# EAGLE schematic EPS (EAGLE 7.5.0)

## Sheet 1 of 3
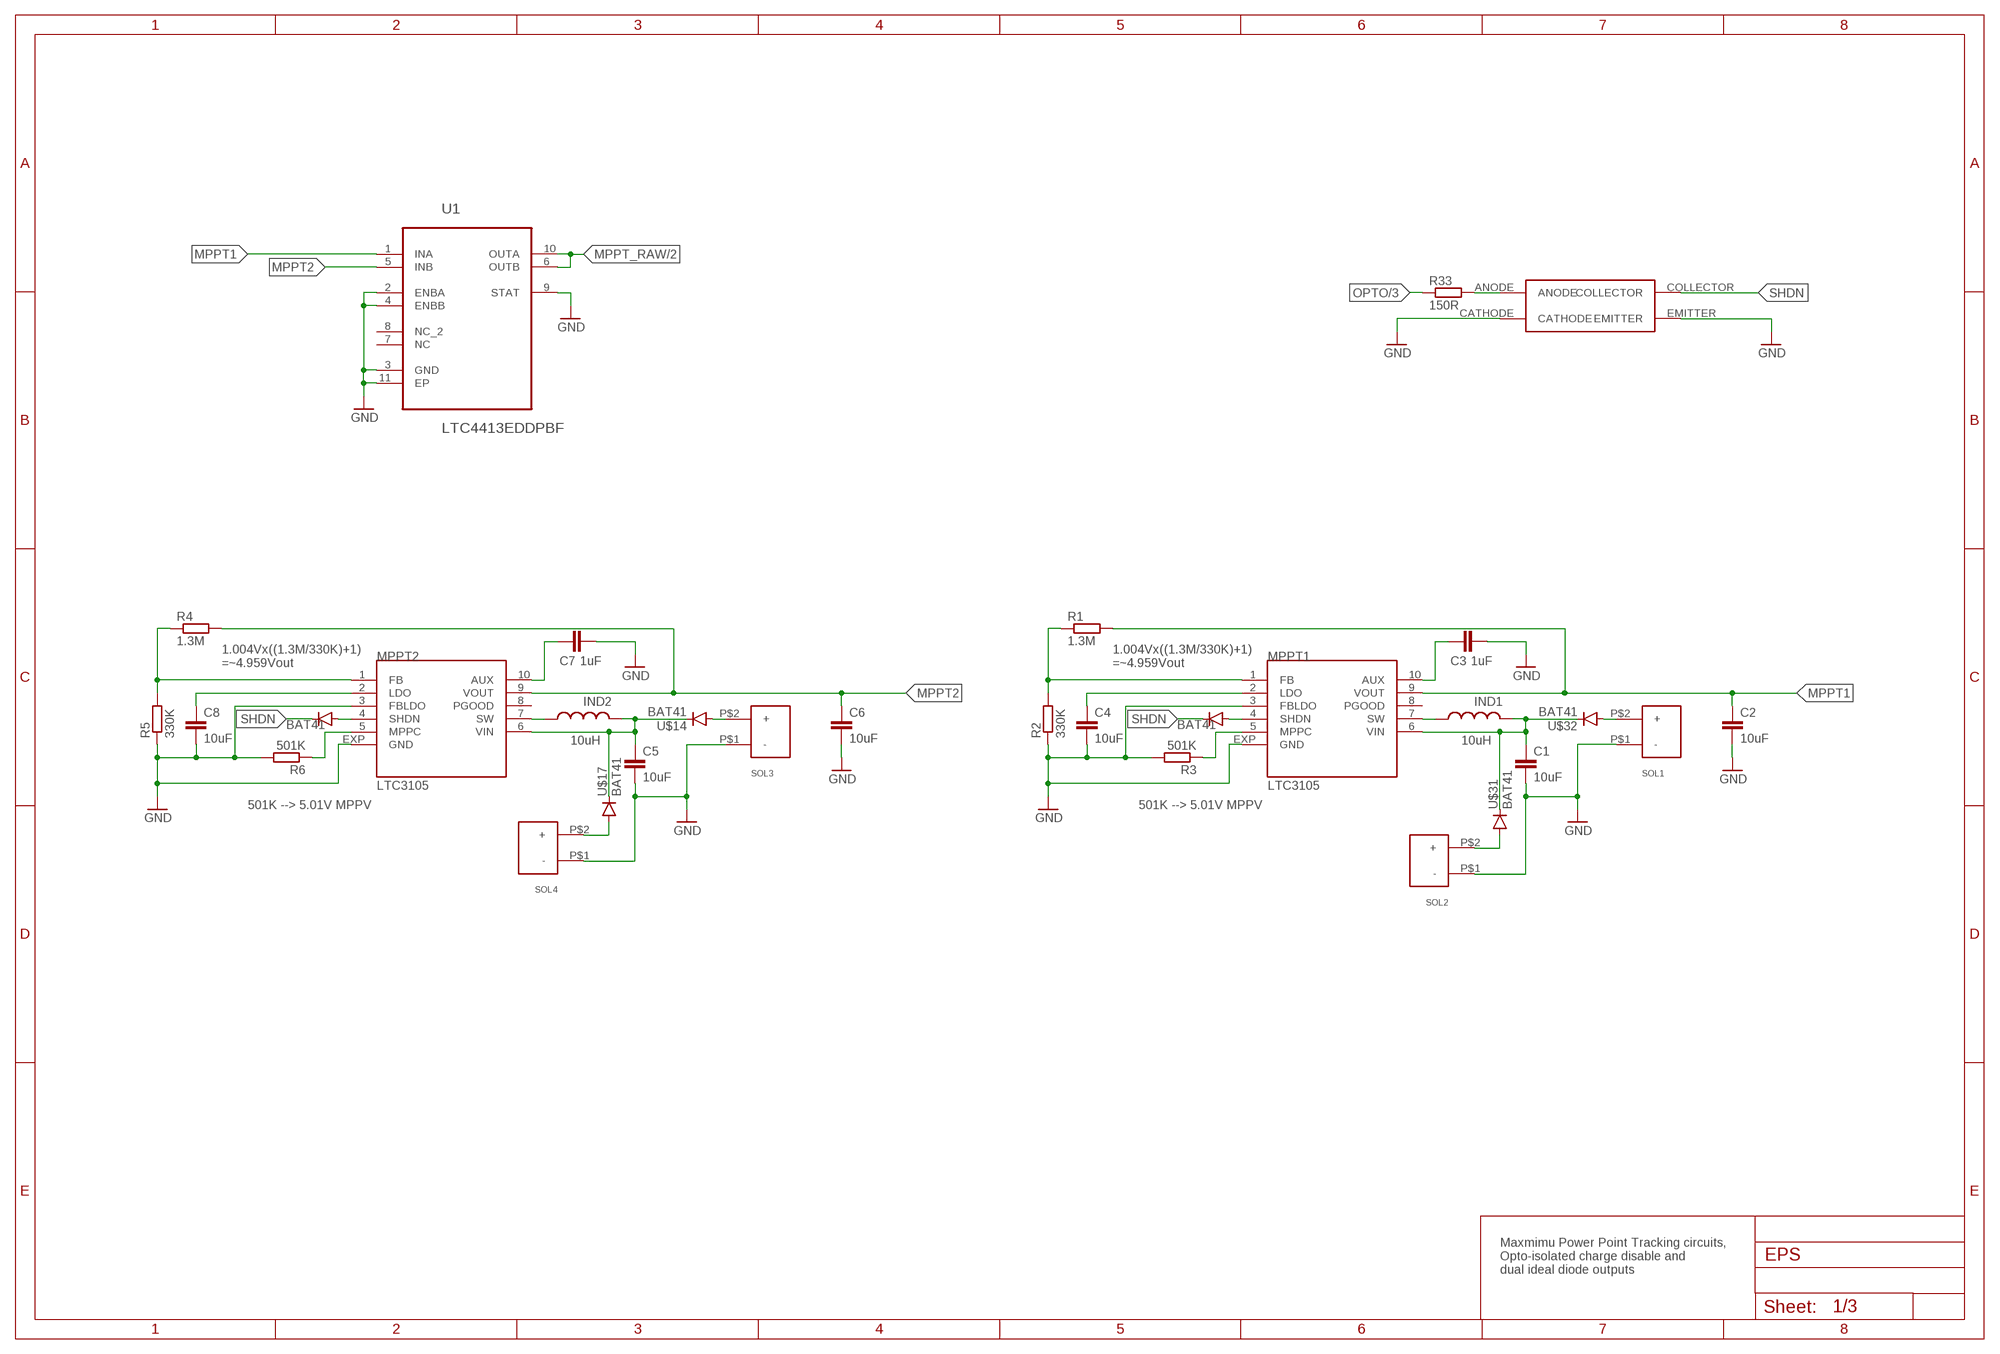
[diagram p0: schematic, sheet 1]

### Parts
C1  10uF  C-EUC0603  [C0603]
C2  10uF  C-EUC0603  [C0603]
C3  1uF  C-EUC0402  [C0402]
C4  10uF  C-EUC0603  [C0603]
C5  10uF  C-EUC0603  [C0603]
C6  10uF  C-EUC0603  [C0603]
C7  1uF  C-EUC0402  [C0402]
C8  10uF  C-EUC0603  [C0603]
IND1  WE-TPC-744031100  [WE-TPC-744031100]
IND2  WE-TPC-744031100  [WE-TPC-744031100]
MPPT1  LTC3105  [DFN-3X3]
MPPT2  LTC3105  [DFN-3X3]
R1  1.3M  R-EU_R0402  [R0402]
R2  330K  R-EU_R0402  [R0402]
R3  501K  R-EU_R0402  [R0402]
R4  1.3M  R-EU_R0402  [R0402]
R5  330K  R-EU_R0402  [R0402]
R6  501K  R-EU_R0402  [R0402]
R33  150R  R-EU_R0402  [R0402]
SOL1  JST-B2B-ZH  [JST-B2B-ZR]
SOL2  JST-B2B-ZH  [JST-B2B-ZR]
SOL3  JST-B2B-ZH  [JST-B2B-ZR]
SOL4  JST-B2B-ZH  [JST-B2B-ZR]
U1  LTC4413EDDPBF  [DFN300X300X80-11N]
U$4  BAT41  [SOD-123]
U$10  BAT41  [SOD-123]
U$14  BAT41  [SOD-123]
U$17  BAT41  [SOD-123]
U$24  EL3H7  [EL3H7]
U$31  BAT41  [SOD-123]
U$32  BAT41  [SOD-123]

### Nets
GND: C1.2 C2.2 C3.2 C4.2 C5.2 C6.2 C7.2 C8.2 MPPT1.3(FBLDO) MPPT1.EXP(GND) MPPT2.3(FBLDO) MPPT2.EXP(GND) R2.1 R3.2 R5.1 R6.2 SOL1.P$1(-) SOL2.P$1(-) SOL3.P$1(-) SOL4.P$1(-) U1.2(ENBA) U1.3(GND) U1.4(ENBB) U1.9(STAT) U1.11(EP) U$24.CATHODE U$24.EMITTER ; also sheet 2,3
MPPT1: C2.1 MPPT1.9(VOUT) R1.2 U1.1(INA)
MPPT2: C6.1 MPPT2.9(VOUT) R4.2 U1.5(INB)
MPPT_RAW: U1.6(OUTB) U1.10(OUTA) ; also sheet 2,3
N$1: IND1.P$1 MPPT1.7(SW)
N$2: C1.1 IND1.P$3 MPPT1.6(VIN) U$31.P$1(C) U$32.P$1(C)
N$3: IND2.P$1 MPPT2.7(SW)
N$4: C3.1 MPPT1.10(AUX)
N$5: C7.1 MPPT2.10(AUX)
N$6: C5.1 IND2.P$3 MPPT2.6(VIN) U$14.P$1(C) U$17.P$1(C)
N$7: MPPT2.1(FB) R4.1 R5.2
N$8: C4.1 MPPT1.2(LDO)
N$9: MPPT1.1(FB) R1.1 R2.2
N$10: MPPT2.5(MPPC) R6.1
N$11: C8.1 MPPT2.2(LDO)
N$12: MPPT2.4(SHDN) U$10.P$2(A)
N$13: SOL4.P$2(+) U$17.P$2(A)
N$14: MPPT1.4(SHDN) U$4.P$2(A)
N$15: MPPT1.5(MPPC) R3.1
N$16: SOL3.P$2(+) U$14.P$2(A)
N$17: SOL2.P$2(+) U$31.P$2(A)
N$18: SOL1.P$2(+) U$32.P$2(A)
N$33: R33.2 U$24.ANODE
OPTO: R33.1 ; also sheet 3
SHDN: U$4.P$1(C) U$10.P$1(C) U$24.COLLECTOR
Unconnected: MPPT1.8(PGOOD) MPPT2.8(PGOOD) U1.7(NC) U1.8(NC_2)

### Notes on the sheet
- 1.004Vx((1.3M/330K)+1)
  =~4.959Vout
- 1.004Vx((1.3M/330K)+1)
  =~4.959Vout
- 10uH | 10uH
- 501K --> 5.01V MPPV | 501K --> 5.01V MPPV
- Maxmimu Power Point Tracking circuits,
  Opto-isolated charge disable and
  dual ideal diode outputs

## Sheet 2 of 3
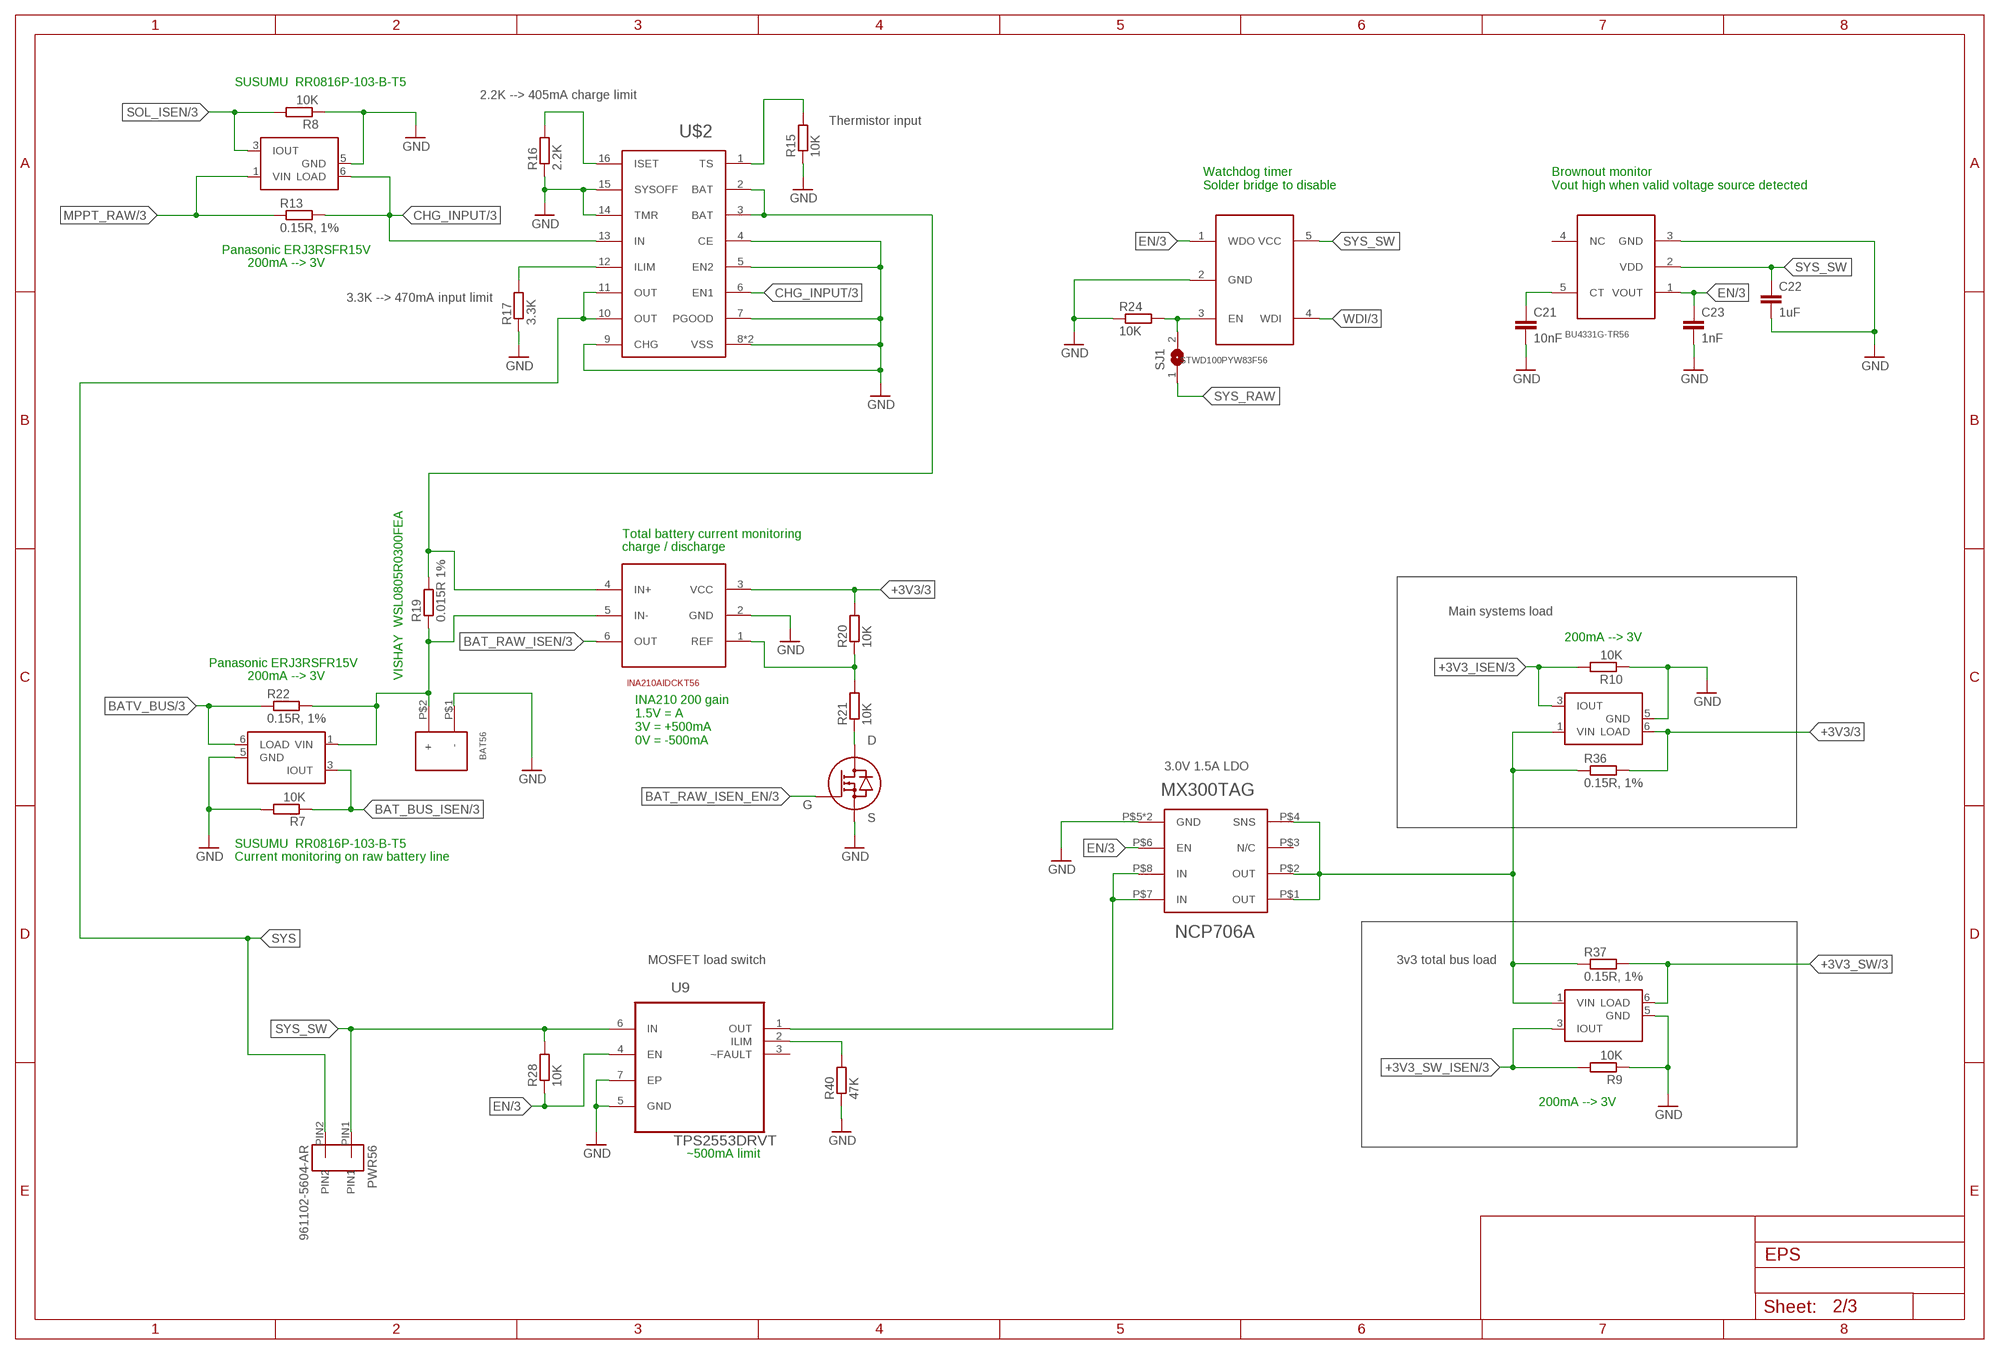
[diagram p1: schematic, sheet 2]

### Parts
BAT56  JST-B2B-ZH  [JST-B2B-ZR]
BU4331G-TR56  BU4231G-TR  [SSOP5]
C21  10nF  C-EUC0402  [C0402]
C22  1uF  C-EUC0402  [C0402]
C23  1nF  C-EUC0402  [C0402]
INA210AIDCKT56  INA211A  [SC-70]
PWR56  961102-5604-AR  [961102-5604-AR]
R7  10K  R-EU_R0402  [R0402]
R8  10K  R-EU_R0402  [R0402]
R9  10K  R-EU_R0402  [R0402]
R10  10K  R-EU_R0402  [R0402]
R13  0.15R, 1%  R-EU_R0603  [R0603]
R15  10K  R-EU_R0402  [R0402]
R16  2.2K  R-EU_R0402  [R0402]
R17  3.3K  R-EU_R0402  [R0402]
R19  0.015R 1%  R-EU_R0603  [R0603]
R20  10K  R-EU_R0402  [R0402]
R21  10K  R-EU_R0402  [R0402]
R22  0.15R, 1%  R-EU_R0603  [R0603]
R24  10K  R-EU_R0402  [R0402]
R28  10K  R-EU_R0402  [R0402]
R36  0.15R, 1%  R-EU_R0603  [R0603]
R37  0.15R, 1%  R-EU_R0603  [R0603]
R40  47K  R-EU_R0402  [R0402]
SJ1  SJ  [SJ]
STWD100PYW83F56  STWD100PYW83F  [SOT_323-5]
U9  TPS2553DRVT  [SON65P200X200X80-7N]
U$2  BQ24079  [PVQFN16-THERM]
U$15  PMV40UN2  [SOT23-3]
U$18  FAN4010IL6X_F113  [FAN4010IL6X_F113]
U$19  FAN4010IL6X_F113  [FAN4010IL6X_F113]
U$20  NCP706AMX300TAG  [XDFN8]
U$25  FAN4010IL6X_F113  [FAN4010IL6X_F113]
U$26  FAN4010IL6X_F113  [FAN4010IL6X_F113]

### Nets
+3V3: INA210AIDCKT56.3(VCC) R20.2 R36.2 U$25.6(LOAD) ; also sheet 3
+3V3_ISEN: R10.2 U$25.3(IOUT) ; also sheet 3
+3V3_REG: R36.1 R37.1 U$20.P$1(OUT) U$20.P$2(OUT) U$20.P$4(SNS) U$25.1(VIN) U$26.1(VIN)
+3V3_SW: R37.2 U$26.6(LOAD) ; also sheet 3
+3V3_SW_ISEN: R9.2 U$26.3(IOUT) ; also sheet 3
BAT_BUS_ISEN: R7.1 U$19.3(IOUT) ; also sheet 3
BAT_RAW_ISEN: INA210AIDCKT56.6(OUT) ; also sheet 3
BAT_RAW_ISEN_EN: U$15.1(G) ; also sheet 3
BATV_BUS: R22.1 U$19.6(LOAD) ; also sheet 3
CHG_INPUT: R13.2 U$2.6(EN1) U$2.13(IN) U$18.6(LOAD) ; also sheet 3
EN: BU4331G-TR56.1(VOUT) C23.1 R28.1 STWD100PYW83F56.1(WDO) U9.4(EN) U$20.P$6(EN) ; also sheet 3
GND: BAT56.P$1(-) BU4331G-TR56.3(GND) C21.2 C22.2 C23.2 INA210AIDCKT56.2(GND) R7.2 R8.1 R9.1 R10.1 R15.1 R16.1 R17.1 R24.1 R40.1 STWD100PYW83F56.2(GND) U9.5(GND) U9.7(EP) U$2.4(CE) U$2.5(EN2) U$2.7(PGOOD) U$2.8(VSS) U$2.9(CHG) U$2.14(TMR) U$2.15(SYSOFF) U$2.17(VSS) U$15.2(S) U$18.5(GND) U$19.5(GND) U$20.P$5(GND) U$20.P$9(GND) U$25.5(GND) U$26.5(GND) ; also sheet 1,3
MPPT_RAW: R13.1 U$18.1(VIN) ; also sheet 1,3
N$29: INA210AIDCKT56.4(IN+) R19.2 U$2.2(BAT) U$2.3(BAT)
N$30: R15.2 U$2.1(TS)
N$31: R16.2 U$2.16(ISET)
N$32: R17.2 U$2.12(ILIM)
N$37: BAT56.P$2(+) INA210AIDCKT56.5(IN-) R19.1 R22.2 U$19.1(VIN)
N$38: R21.1 U$15.3(D)
N$39: INA210AIDCKT56.1(REF) R20.1 R21.2
N$40: BU4331G-TR56.5(CT) C21.1
N$43: R24.2 SJ1.2 STWD100PYW83F56.3(EN)
N$44: R40.2 U9.2(ILIM)
SOL_ISEN: R8.2 U$18.3(IOUT) ; also sheet 3
SYS: PWR56.PIN2 U$2.10(OUT) U$2.11(OUT)
SYS_RAW: SJ1.1 U9.1(OUT) U$20.P$7(IN) U$20.P$8(IN)
SYS_SW: BU4331G-TR56.2(VDD) C22.1 PWR56.PIN1 R28.2 STWD100PYW83F56.5(VCC) U9.6(IN)
WDI: STWD100PYW83F56.4(WDI) ; also sheet 3
Unconnected: BU4331G-TR56.4(NC) U9.3(~FAULT) U$18.2(NC) U$18.4(NC) U$19.2(NC) U$19.4(NC) U$20.P$3(N/C) U$25.2(NC) U$25.4(NC) U$26.2(NC) U$26.4(NC)

### Notes on the sheet
- SUSUMU  RR0816P-103-B-T5
- 2.2K --> 405mA charge limit
- Thermistor input
- Watchdog timer
  Solder bridge to disable
- Brownout monitor
  Vout high when valid voltage source detected
- Panasonic ERJ3RSFR15V
- 200mA --> 3V
- 3.3K --> 470mA input limit
- Total battery current monitoring
- charge / discharge
- Main systems load
- 200mA --> 3V
- Panasonic ERJ3RSFR15V
- 200mA --> 3V | VISHAY  WSL0805R0300FEA
- INA210 200 gain
  1.5V = A
  3V = +500mA
  0V = -500mA
- 3.0V 1.5A LDO
- SUSUMU  RR0816P-103-B-T5
- Current monitoring on raw battery line
- MOSFET load switch | 3v3 total bus load
- 200mA --> 3V
- ~500mA limit

## Sheet 3 of 3
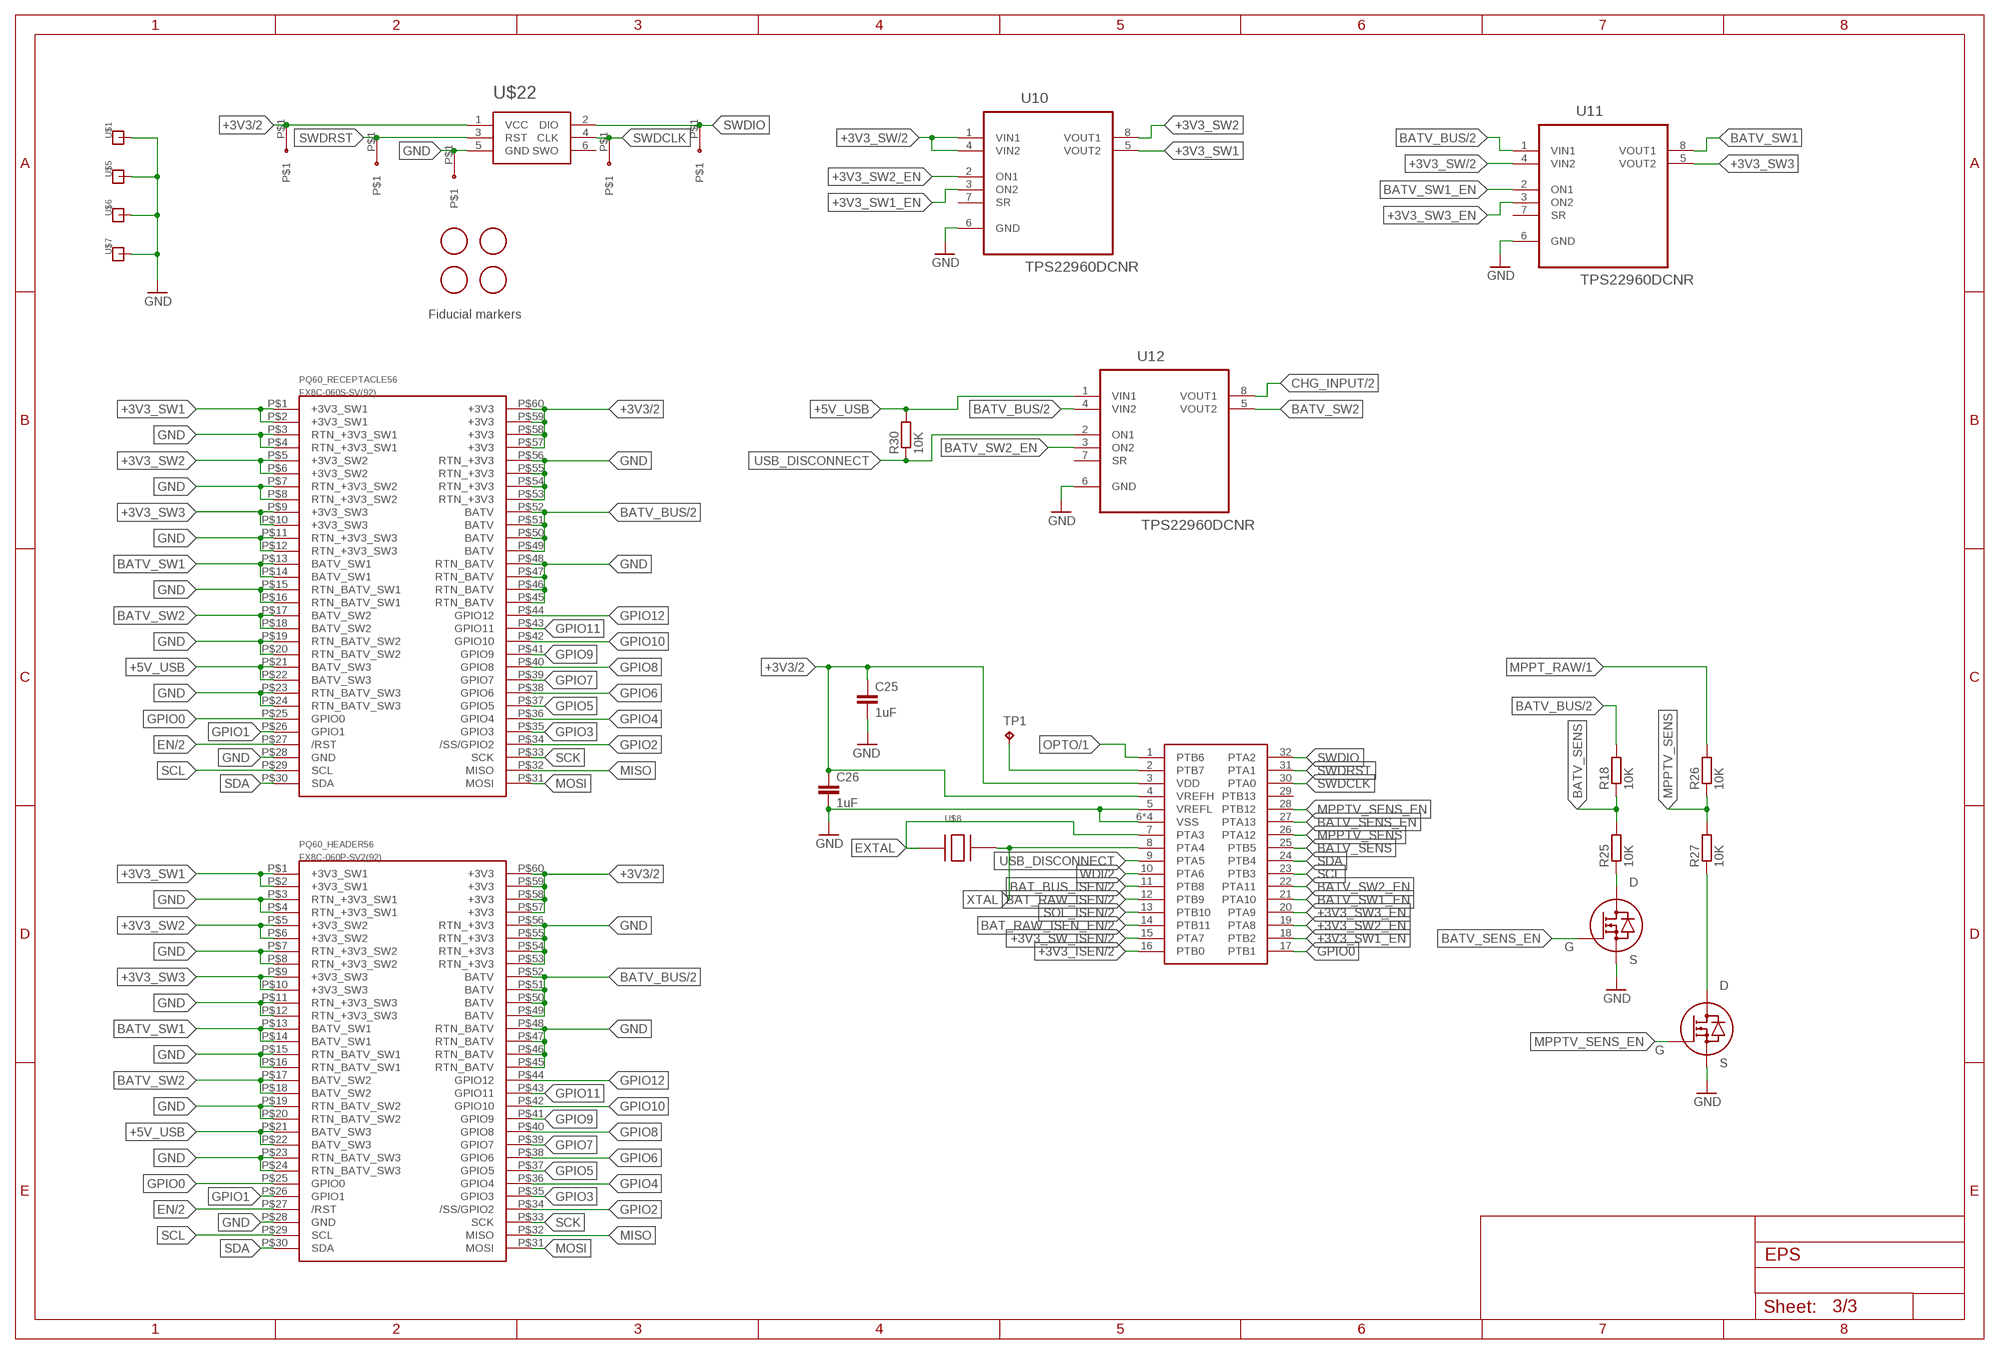
[diagram p2: schematic, sheet 3]

### Parts
C25  1uF  C-EUC0402  [C0402]
C26  1uF  C-EUC0402  [C0402]
FD1  FIDUCIAL  [FIDUCIAL_1MM]
FD2  FIDUCIAL  [FIDUCIAL_1MM]
FD3  FIDUCIAL  [FIDUCIAL_1MM]
FD4  FIDUCIAL  [FIDUCIAL_1MM]
PQ60_HEADER56  FX8C-060P-SV2(92)  [FX8C-060P-SV(92)]
PQ60_RECEPTACLE56  FX8C-060S-SV(92)  [FX8C-060S-SV(92)]
R18  10K  R-EU_R0402  [R0402]
R25  10K  R-EU_R0402  [R0402]
R26  10K  R-EU_R0402  [R0402]
R27  10K  R-EU_R0402  [R0402]
R30  10K  R-EU_R0402  [R0402]
TP1  TPTP07R  [TP07R]
U10  TPS22960DCNR  [SOT65P280X145-8N]
U11  TPS22960DCNR  [SOT65P280X145-8N]
U12  TPS22960DCNR  [SOT65P280X145-8N]
U$1  3MMPILAR  [3MMPILAR]
U$3  DEBUG-TP  [DEBUG-TP]
U$5  3MMPILAR  [3MMPILAR]
U$6  3MMPILAR  [3MMPILAR]
U$7  3MMPILAR  [3MMPILAR]
U$8  ABS25_32.768KHZ  [ABS25]
U$11  PMV40UN2  [SOT23-3]
U$12  PMV40UN2  [SOT23-3]
U$16  DEBUG-TP  [DEBUG-TP]
U$21  MKL02Z16VFM4  [MKL02Z16VFM4]
U$22  TAG_CONNECT  [TAG_CONNECT]
U$23  DEBUG-TP  [DEBUG-TP]
U$27  DEBUG-TP  [DEBUG-TP]
U$28  DEBUG-TP  [DEBUG-TP]

### Nets
+3V3: C25.1 C26.1 PQ60_HEADER56.P$57(+3V3) PQ60_HEADER56.P$58(+3V3) PQ60_HEADER56.P$59(+3V3) PQ60_HEADER56.P$60(+3V3) PQ60_RECEPTACLE56.P$57(+3V3) PQ60_RECEPTACLE56.P$58(+3V3) PQ60_RECEPTACLE56.P$59(+3V3) PQ60_RECEPTACLE56.P$60(+3V3) U$3.P$1 U$21.3(VDD) U$21.4(VREFH) U$22.1(VCC) ; also sheet 2
+3V3_ISEN: U$21.16(PTB0) ; also sheet 2
+3V3_SW: U10.1(VIN1) U10.4(VIN2) U11.4(VIN2) ; also sheet 2
+3V3_SW1: PQ60_HEADER56.P$1(+3V3_SW1) PQ60_HEADER56.P$2(+3V3_SW1) PQ60_RECEPTACLE56.P$1(+3V3_SW1) PQ60_RECEPTACLE56.P$2(+3V3_SW1) U10.5(VOUT2)
+3V3_SW1_EN: U10.3(ON2) U$21.18(PTB2)
+3V3_SW2: PQ60_HEADER56.P$5(+3V3_SW2) PQ60_HEADER56.P$6(+3V3_SW2) PQ60_RECEPTACLE56.P$5(+3V3_SW2) PQ60_RECEPTACLE56.P$6(+3V3_SW2) U10.8(VOUT1)
+3V3_SW2_EN: U10.2(ON1) U$21.19(PTA8)
+3V3_SW3: PQ60_HEADER56.P$9(+3V3_SW3) PQ60_HEADER56.P$10(+3V3_SW3) PQ60_RECEPTACLE56.P$9(+3V3_SW3) PQ60_RECEPTACLE56.P$10(+3V3_SW3) U11.5(VOUT2)
+3V3_SW3_EN: U11.3(ON2) U$21.20(PTA9)
+3V3_SW_ISEN: U$21.15(PTA7) ; also sheet 2
+5V_USB: PQ60_HEADER56.P$21(BATV_SW3) PQ60_HEADER56.P$22(BATV_SW3) PQ60_RECEPTACLE56.P$21(BATV_SW3) PQ60_RECEPTACLE56.P$22(BATV_SW3) R30.2 U12.1(VIN1)
BAT_BUS_ISEN: U$21.11(PTB8) ; also sheet 2
BAT_RAW_ISEN: U$21.12(PTB9) ; also sheet 2
BAT_RAW_ISEN_EN: U$21.14(PTB11) ; also sheet 2
BATV_BUS: PQ60_HEADER56.P$49(BATV) PQ60_HEADER56.P$50(BATV) PQ60_HEADER56.P$51(BATV) PQ60_HEADER56.P$52(BATV) PQ60_RECEPTACLE56.P$49(BATV) PQ60_RECEPTACLE56.P$50(BATV) PQ60_RECEPTACLE56.P$51(BATV) PQ60_RECEPTACLE56.P$52(BATV) R18.2 U11.1(VIN1) U12.4(VIN2) ; also sheet 2
BATV_SENS: R18.1 R25.2 U$21.25(PTB5)
BATV_SENS_EN: U$11.1(G) U$21.27(PTA13)
BATV_SW1: PQ60_HEADER56.P$13(BATV_SW1) PQ60_HEADER56.P$14(BATV_SW1) PQ60_RECEPTACLE56.P$13(BATV_SW1) PQ60_RECEPTACLE56.P$14(BATV_SW1) U11.8(VOUT1)
BATV_SW1_EN: U11.2(ON1) U$21.21(PTA10)
BATV_SW2: PQ60_HEADER56.P$17(BATV_SW2) PQ60_HEADER56.P$18(BATV_SW2) PQ60_RECEPTACLE56.P$17(BATV_SW2) PQ60_RECEPTACLE56.P$18(BATV_SW2) U12.5(VOUT2)
BATV_SW2_EN: U12.3(ON2) U$21.22(PTA11)
CHG_INPUT: U12.8(VOUT1) ; also sheet 2
EN: PQ60_HEADER56.P$27(/RST) PQ60_RECEPTACLE56.P$27(/RST) ; also sheet 2
EXTAL: U$8.1 U$21.7(PTA3)
GND: C25.2 C26.2 PQ60_HEADER56.P$3(RTN_+3V3_SW1) PQ60_HEADER56.P$4(RTN_+3V3_SW1) PQ60_HEADER56.P$7(RTN_+3V3_SW2) PQ60_HEADER56.P$8(RTN_+3V3_SW2) PQ60_HEADER56.P$11(RTN_+3V3_SW3) PQ60_HEADER56.P$12(RTN_+3V3_SW3) PQ60_HEADER56.P$15(RTN_BATV_SW1) PQ60_HEADER56.P$16(RTN_BATV_SW1) PQ60_HEADER56.P$19(RTN_BATV_SW2) PQ60_HEADER56.P$20(RTN_BATV_SW2) PQ60_HEADER56.P$23(RTN_BATV_SW3) PQ60_HEADER56.P$24(RTN_BATV_SW3) PQ60_HEADER56.P$28(GND) PQ60_HEADER56.P$45(RTN_BATV) PQ60_HEADER56.P$46(RTN_BATV) PQ60_HEADER56.P$47(RTN_BATV) PQ60_HEADER56.P$48(RTN_BATV) PQ60_HEADER56.P$53(RTN_+3V3) PQ60_HEADER56.P$54(RTN_+3V3) PQ60_HEADER56.P$55(RTN_+3V3) PQ60_HEADER56.P$56(RTN_+3V3) PQ60_RECEPTACLE56.P$3(RTN_+3V3_SW1) PQ60_RECEPTACLE56.P$4(RTN_+3V3_SW1) PQ60_RECEPTACLE56.P$7(RTN_+3V3_SW2) PQ60_RECEPTACLE56.P$8(RTN_+3V3_SW2) PQ60_RECEPTACLE56.P$11(RTN_+3V3_SW3) PQ60_RECEPTACLE56.P$12(RTN_+3V3_SW3) PQ60_RECEPTACLE56.P$15(RTN_BATV_SW1) PQ60_RECEPTACLE56.P$16(RTN_BATV_SW1) PQ60_RECEPTACLE56.P$19(RTN_BATV_SW2) PQ60_RECEPTACLE56.P$20(RTN_BATV_SW2) PQ60_RECEPTACLE56.P$23(RTN_BATV_SW3) PQ60_RECEPTACLE56.P$24(RTN_BATV_SW3) PQ60_RECEPTACLE56.P$28(GND) PQ60_RECEPTACLE56.P$45(RTN_BATV) PQ60_RECEPTACLE56.P$46(RTN_BATV) PQ60_RECEPTACLE56.P$47(RTN_BATV) PQ60_RECEPTACLE56.P$48(RTN_BATV) PQ60_RECEPTACLE56.P$53(RTN_+3V3) PQ60_RECEPTACLE56.P$54(RTN_+3V3) PQ60_RECEPTACLE56.P$55(RTN_+3V3) PQ60_RECEPTACLE56.P$56(RTN_+3V3) U10.6(GND) U11.6(GND) U12.6(GND) U$1.P$1 U$5.P$1 U$6.P$1 U$7.P$1 U$11.2(S) U$12.2(S) U$21.5(VREFL) U$21.6(VSS) U$21.GND@1(VSS) U$21.GND@2(VSS) U$21.GND@3(VSS) U$22.5(GND) U$23.P$1 ; also sheet 1,2
GPIO0: PQ60_HEADER56.P$25(GPIO0) PQ60_RECEPTACLE56.P$25(GPIO0) U$21.17(PTB1)
GPIO1: PQ60_HEADER56.P$26(GPIO1) PQ60_RECEPTACLE56.P$26(GPIO1)
GPIO2: PQ60_HEADER56.P$34(/SS/GPIO2) PQ60_RECEPTACLE56.P$34(/SS/GPIO2)
GPIO3: PQ60_HEADER56.P$35(GPIO3) PQ60_RECEPTACLE56.P$35(GPIO3)
GPIO4: PQ60_HEADER56.P$36(GPIO4) PQ60_RECEPTACLE56.P$36(GPIO4)
GPIO5: PQ60_HEADER56.P$37(GPIO5) PQ60_RECEPTACLE56.P$37(GPIO5)
GPIO6: PQ60_HEADER56.P$38(GPIO6) PQ60_RECEPTACLE56.P$38(GPIO6)
GPIO7: PQ60_HEADER56.P$39(GPIO7) PQ60_RECEPTACLE56.P$39(GPIO7)
GPIO8: PQ60_HEADER56.P$40(GPIO8) PQ60_RECEPTACLE56.P$40(GPIO8)
GPIO9: PQ60_HEADER56.P$41(GPIO9) PQ60_RECEPTACLE56.P$41(GPIO9)
GPIO10: PQ60_HEADER56.P$42(GPIO10) PQ60_RECEPTACLE56.P$42(GPIO10)
GPIO11: PQ60_HEADER56.P$43(GPIO11) PQ60_RECEPTACLE56.P$43(GPIO11)
GPIO12: PQ60_HEADER56.P$44(GPIO12) PQ60_RECEPTACLE56.P$44(GPIO12)
MISO: PQ60_HEADER56.P$32(MISO) PQ60_RECEPTACLE56.P$32(MISO)
MOSI: PQ60_HEADER56.P$31(MOSI) PQ60_RECEPTACLE56.P$31(MOSI)
MPPT_RAW: R26.2 ; also sheet 1,2
MPPTV_SENS: R26.1 R27.2 U$21.26(PTA12)
MPPTV_SENS_EN: U$12.1(G) U$21.28(PTB12)
N$19: TP1.TP U$21.2(PTB7)
N$35: R25.1 U$11.3(D)
N$36: R27.1 U$12.3(D)
OPTO: U$21.1(PTB6) ; also sheet 1
SCK: PQ60_HEADER56.P$33(SCK) PQ60_RECEPTACLE56.P$33(SCK)
SCL: PQ60_HEADER56.P$29(SCL) PQ60_RECEPTACLE56.P$29(SCL) U$21.23(PTB3)
SDA: PQ60_HEADER56.P$30(SDA) PQ60_RECEPTACLE56.P$30(SDA) U$21.24(PTB4)
SOL_ISEN: U$21.13(PTB10) ; also sheet 2
SWDCLK: U$21.30(PTA0) U$22.4(CLK) U$27.P$1
SWDIO: U$21.32(PTA2) U$22.2(DIO) U$28.P$1
SWDRST: U$16.P$1 U$21.31(PTA1) U$22.3(RST)
USB_DISCONNECT: R30.1 U12.2(ON1) U$21.9(PTA5)
WDI: U$21.10(PTA6) ; also sheet 2
XTAL: U$8.4 U$21.8(PTA4)
Unconnected: U10.7(SR) U11.7(SR) U12.7(SR) U$21.29(PTB13) U$22.6(SWO)

### Notes on the sheet
- Fiducial markers

## Library data of the parts
BAT56 SOL1-SOL4 = ubo_PQ60:JST-B2B-ZH
BU4331G-TR56 = EPS_PQ60:BU4231G-TR
C1-C8 C21-C23 C25 C26 = resistor:C-EU: CAPACITOR, European symbol
FD1-FD4 = adafruit:FIDUCIAL: For use by pick and place machines to calibrate the vision/machine, 1mm By microbuilder.eu
INA210AIDCKT56 = ubo_PQ60:INA211A
IND1 IND2 = ubo_PQ60:WE-TPC-744031100
MPPT1 MPPT2 = ubo_PQ60:LTC3105
PQ60_HEADER56 = OBC:FX8C-060P-SV2(92)
PQ60_RECEPTACLE56 = Template:FX8C-060S-SV(92)
PWR56 = ubo_PQ60:961102-5604-AR
R1-R10 R13 R15-R22 R24-R28 R30 R33 R36 R37 R40 = resistor:R-EU_: RESISTOR, European symbol
SJ1 = ubo_PQ60:SJ: SMD solder JUMPER
STWD100PYW83F56 = ubo_PQ60:STWD100PYW83F
TP1 = testpad:TP: Test pad
U1 = ubo_PQ60:LTC4413EDDPBF: Dual 2.6A, 2.5V to 5.5V, Ideal Diodes; MPN: LTC4413EDD#PBF; OC_FARNELL: 1663736; OC_NEWARK: 56M9529; PACKAGE: DFN-10; SUPPLIER: Linear Technology
U9 = ubo_PQ60:TPS2553DRVT: POWER-DISTRIBUTION SWITCHES; MPN: TPS2553DRVT; OC_FARNELL: 1694427; OC_NEWARK: 40P3872; PACKAGE: SON-6; SUPPLIER: TEXAS INSTRUMENTS
U10-U12 = ubo_PQ60:TPS22960DCNR: LOW INPUT VOLTAGE, DUAL LOAD SWITCH WITH CONTROLLED TURN-ON; MPN: TPS22960DCNR; OC_FARNELL: 1735581; OC_NEWARK: 10R1440; PACKAGE: SOT-23-8; SUPPLIER: TEXAS INSTRUMENTS
U$1 U$5-U$7 = ubo_PQ60:3MMPILAR
U$2 = ubo_PQ60:BQ24079
U$3 U$16 U$23 U$27 U$28 = ubo_PQ60:DEBUG-TP
U$4 U$10 U$14 U$17 U$31 U$32 = ubo_PQ60:BAT41
U$8 = ubo_PQ60:ABS25_32.768KHZ
U$11 U$12 U$15 = ubo_PQ60:PMV40UN2
U$18 U$19 U$25 U$26 = ubo_PQ60:FAN4010IL6X_F113
U$20 = ubo_PQ60:NCP706AMX300TAG
U$21 = OBC:MKL02Z16VFM4
U$22 = ubo_PQ60:TAG_CONNECT
U$24 = ubo_PQ60:EL3H7